# Altium schematic sheet mcu.SchDoc
size A3
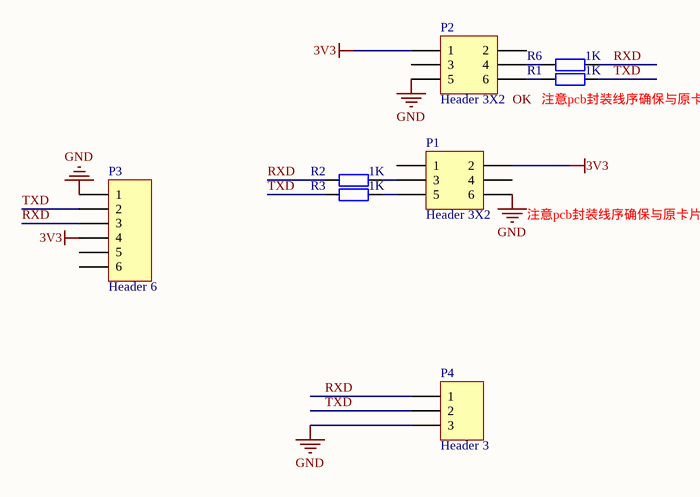
[diagram p0: mcu.SchDoc]

## Parts
P1  Header 3X2  [3x2X2MM]
P2  Header 3X2  [3x2X2MM]
P3  Header 6  [5X2MMZ]
P4  Header 3  [HDR1X3]
R1  1K  [0603R]
R2  1K  [0603R]
R3  1K  [0603R]
R6  1K  [0603R]

## Nets
3V3: P1.2 P2.1 P3.4
GND: P1.6 P2.5 P3.1 P4.3
RXD: P3.3 P4.1 R2.2 R6.1
TXD: P3.2 P4.2 R1.1 R3.2
NetP1_3: P1.3 R2.1
NetP1_5: P1.5 R3.1
NetP2_4: P2.4 R6.2
NetP2_6: P2.6 R1.2

Not connected (* = marked no-connect by the designer): P1 1 4; P2 2 3; P3 5 6

## Notes on the sheet
- (near R1) 注意pcb封装线序确保与原卡片接口一致
- (near P1) 注意pcb封装线序确保与原卡片接口一致
- Labels drawn without touching a wire or pin: OK

## Library data of the parts
P1 P2 = Header 3X2: Header, 3-Pin, Dual row; LatestRevisionDate: 17-Jul-2002; LatestRevisionNote: Re-released for DXP Platform.; Publisher: Altium Limited
P3 = Header 6: Header, 6-Pin; LatestRevisionDate: 17-Jul-2002; LatestRevisionNote: Re-released for DXP Platform.; Publisher: Altium Limited
P4 = Header 3: Header, 3-Pin; LatestRevisionDate: 17-Jul-2002; LatestRevisionNote: Re-released for DXP Platform.; Publisher: Altium Limited
R1-R3 R6 = Res2: Resistor; Value: 10K/5%/1/8W; Published: 8-Jun-2000; LatestRevisionDate: 17-Jul-2002; LatestRevisionNote: Re-released for DXP Platform.; PackageReference: AXIAL-0.4; Publisher: Altium Limited